# EAGLE design Comparator Breakout MAX9031 (EAGLE 9.1.0)
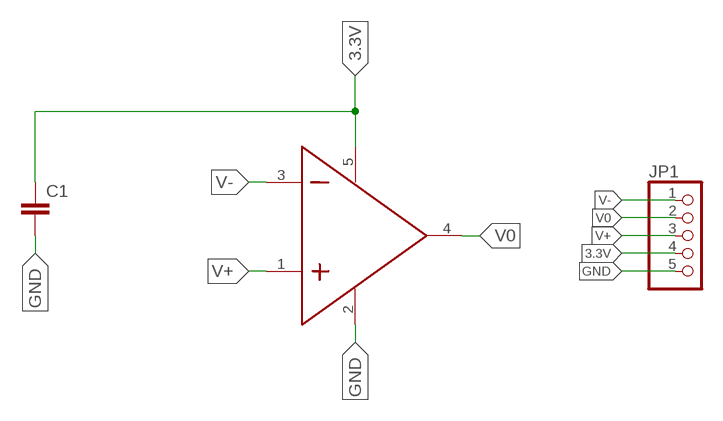
[diagram p0: schematic, sheet 1]

## Parts
C1  C-EUC0805  [C0805]
JP1  PINHD-1X5  [1X05]
U$1  MAX9031  [SOT23-5]

## Nets
3.3V: C1.1 JP1.4 U$1.5(VDD)
GND: C1.2 JP1.5 U$1.2(VSS)
V0: JP1.2 U$1.4(OUT)
V+: JP1.3 U$1.1(IN+)
V-: JP1.1 U$1.3(IN-)

## Library data of the parts
C1 = rcl:C-EU: CAPACITOR, European symbol; SPICEPREFIX: C
JP1 = pinhead:PINHD-1X5: PIN HEADER
U$1 = Personal:MAX9031

## Board
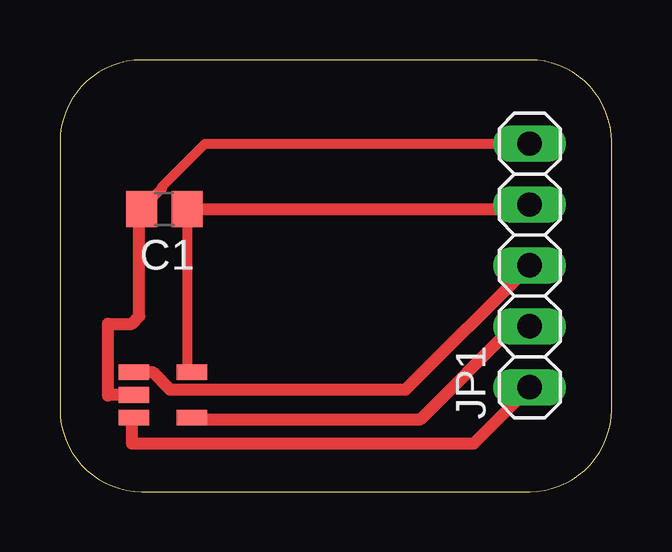
[diagram p1: board, top side]

Size 23 x 18 mm. Coordinates in mm from the lower left corner, seen from the top.
Outline: 19.59,18 3.41,18 arc90 0,14.59 0,3.41 arc90 3.41,0 19.59,0 arc90 23,3.41 23,14.59 arc90 19.59,18
Copper layers (1*16): Top 0.035mm / dielectric 1.5mm / Bottom 0.035mm
Design rules "default": minimum track width 6mil, minimum drill 0.35mm, track to track 6mil, track to pad 6mil, pad to pad 6mil, via to via 6mil, smd to smd 6mil, copper to edge 40mil, drill to drill 6mil, minimum pad ring 10mil, minimum via ring 8mil, stop-mask expansion 4mil, vias tented up to drill 0mil, thermal gap 10mil

### Footprints (pad centres in the part's own frame; a part is rotated, then mirrored left to right if it is on the bottom)
C0805 = smd 1.3 x 1.5: 1 -0.95,0; 2 0.95,0
1X05 = drill 1.016 long: 1 -5.08,0; 2 -2.54,0; 3 0,0; 4 2.54,0; 5 5.08,0
SOT23-5 = smd 0.65 x 1.27: 1 1.9,0; 2 0.95,0; 3 0,0; 4 0,-2.429; 5 1.9,-2.429

### Placement (x,y rotation side)
C1  4.35,11.78 180 top
JP1  19.59,9.43 90 top
U$1  3.08,3.08 90 top

### Tracks (layer width: path | path; a pad name or v marks a point on that pad's centre or on a via)
3.3V
  Top 0.152: 5.3,5.05 U$1.5
  Top 0.406: C1.1 5.3,5.05 5.29,5.04
  Top 0.5: 5.29,5.04 5.28,5.04 | C1.1 19.4,11.78 JP1.4
GND
  Top 0.152: C1.2 3.31,11.69 3,11.38
  Top 0.406: C1.2 4.25,12.63 4.25,12.7 6.06,14.51 JP1.5
  Top 0.5: U$1.2 2.03,4.03 2,4 2,7 3,7 3.31,7.31 3.31,11.69
V0
  Top 0.5: JP1.2 18.89,6.89 15,3 5.36,3 U$1.4
V+
  Top 0.406: 3.13,4.98 U$1.1
  Top 0.5: U$1.1 3.86,4.98 4.58,4.25 14.41,4.25 JP1.3
V-
  Top 0.5: JP1.1 17.24,2 3,2 3,3 U$1.3